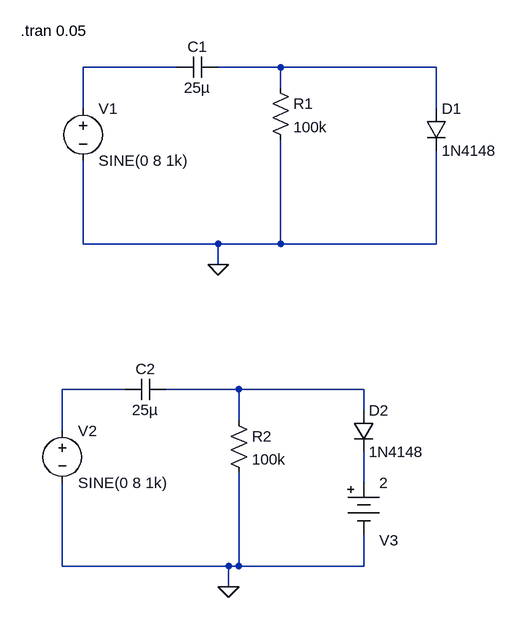
[diagram p0: schematic Ex-6.asc]
Ex-6.asc, the LTspice schematic file:
Version 4
SHEET 1 900 708
WIRE 208 -112 64 -112
WIRE 368 -112 272 -112
WIRE 608 -112 368 -112
WIRE 368 -80 368 -112
WIRE 64 -48 64 -112
WIRE 608 -48 608 -112
WIRE 64 160 64 32
WIRE 272 160 64 160
WIRE 368 160 368 0
WIRE 368 160 272 160
WIRE 608 160 608 16
WIRE 608 160 368 160
WIRE 272 192 272 160
WIRE 128 384 32 384
WIRE 304 384 192 384
WIRE 496 384 304 384
WIRE 496 416 496 384
WIRE 304 432 304 384
WIRE 32 448 32 384
WIRE 496 528 496 480
WIRE 32 656 32 528
WIRE 288 656 32 656
WIRE 304 656 304 512
WIRE 304 656 288 656
WIRE 496 656 496 608
WIRE 496 656 304 656
WIRE 288 688 288 656
FLAG 272 192 0
FLAG 288 688 0
SYMBOL voltage 64 -64 R0
WINDOW 123 0 0 Left 0
WINDOW 39 0 0 Left 0
SYMATTR InstName V1
SYMATTR Value SINE(0 8 1k)
SYMBOL voltage 32 432 R0
WINDOW 123 0 0 Left 0
WINDOW 39 0 0 Left 0
SYMATTR InstName V2
SYMATTR Value SINE(0 8 1k)
SYMBOL cap 272 -128 R90
WINDOW 0 0 32 VBottom 2
WINDOW 3 32 32 VTop 2
SYMATTR InstName C1
SYMATTR Value 25µ
SYMBOL cap 192 368 R90
WINDOW 0 0 32 VBottom 2
WINDOW 3 32 32 VTop 2
SYMATTR InstName C2
SYMATTR Value 25µ
SYMBOL res 352 -96 R0
SYMATTR InstName R1
SYMATTR Value 100k
SYMBOL res 288 416 R0
SYMATTR InstName R2
SYMATTR Value 100k
SYMBOL diode 592 -48 R0
SYMATTR InstName D1
SYMATTR Value 1N4148
SYMBOL diode 480 416 R0
SYMATTR InstName D2
SYMATTR Value 1N4148
SYMBOL Misc\\battery 496 512 R0
WINDOW 0 24 104 Left 2
WINDOW 3 24 16 Left 2
WINDOW 123 0 0 Left 0
WINDOW 39 0 0 Left 0
SYMATTR InstName V3
SYMATTR Value 2
TEXT -32 -168 Left 2 !.tran 0.05

The netlist it stands for:
* Ex-6.asc
V1 N001 0 SINE(0 8 1k)
V2 N003 0 SINE(0 8 1k)
C1 N002 N001 25µ
C2 N004 N003 25µ
R1 N002 0 100k
R2 N004 0 100k
D1 N002 0 1N4148
D2 N004 N005 1N4148
V3 N005 0 2
.model D D
.lib standard.dio
.tran 0.05
.backanno
.end